# Altium schematic sheet STlink.SchDoc
size A4; SheetNumber: 2; SheetTotal: 3
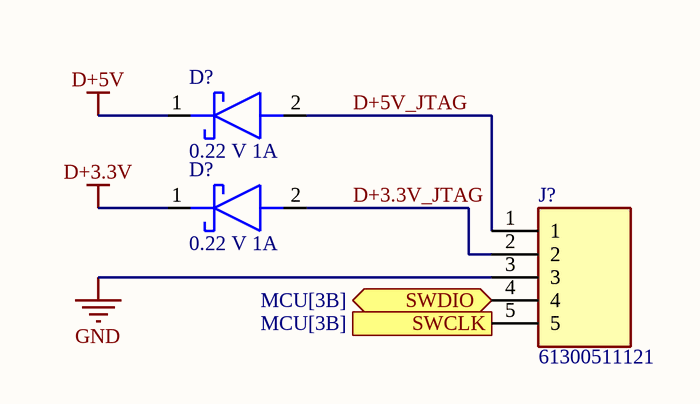
[diagram p0: STlink.SchDoc]

## Parts
(Parts that share a designator on the sheet are numbered #1, #2 ... from top to bottom, then left to right.)
D?#1  0.22 V 1A  [DIOM5436X330N]
D?#2  0.22 V 1A  [DIOM5436X330N]
J?  61300511121  [HDRV5W64P0X254_1X5_1270X254X854P]

## Ports
SWCLK (out, see MCU[3B]), SWDIO (bidir, see MCU[3B])

## Nets
D+3.3V: D?#2.1(K)
D+5V: D?#1.1(K)
GND: J?.3
D+3.3V_JTAG: D?#2.2(A) J?.2
D+5V_JTAG: D?#1.2(A) J?.1
SWCLK: J?.5 ; port SWCLK
SWDIO: J?.4 ; port SWDIO

## Library data of the parts
D?#1 D?#2 = LSM115JE3_TR13: Manufacturer_Name: Microsemi Corporation; Manufacturer_Part_Number: LSM115JE3/TR13; Datasheet Link: https://media.digikey.com/pdf/Data%20Sheets/Microsemi%20PDFs/LSM115J.pdf; Height: 3.3mm; Mouser Part Number: 494-LSM115JE3/TR13; Mouser Price/Stock: https://www.mouser.co.uk/ProductDetail/Microchip-Microsemi/LSM115JE3-TR13/?qs=6jAvgNDGUA8H9k1qUsKdHA%3D%3D; Arrow Part Number: LSM115JE3/TR13; Arrow Price/Stock: https://www.arrow.com/en/products/lsm115je3tr13/microsemi
J? = 61300511121: Connector; Manufacturer_Name: Wurth Elektronik; Datasheet Link: http://katalog.we-online.de/em/datasheet/6130xx11121.pdf; Height: 8.54mm; Manufacturer_Part_Number: 61300511121; Mouser Part Number: 710-61300511121; Mouser Price/Stock: https://www.mouser.co.uk/ProductDetail/Wurth-Elektronik/61300511121?qs=PhR8RmCirEZCsCRHq%252BvfRQ%3D%3D